# Altium schematic sheet 3_FLOATER.SchDoc
size A; SheetNumber: 3; SheetTotal: 3
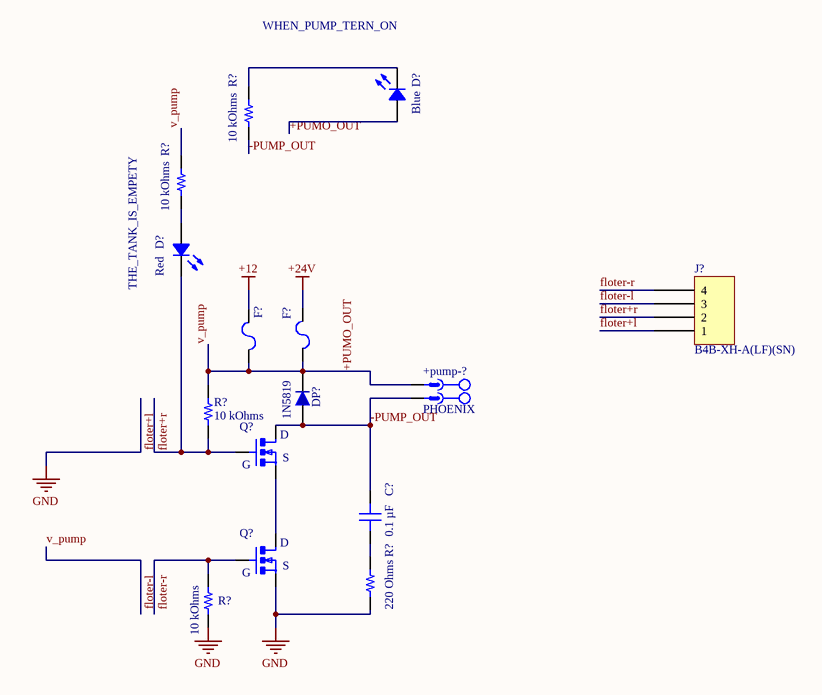
[diagram p0: 3_FLOATER.SchDoc]

## Parts
(Parts that share a designator on the sheet are numbered #1, #2 ... from top to bottom, then left to right.)
+pump-?  PHOENIX  [691321300002]
C?  0.1 µF  [CAP 0603_1608]
D?#1  Blue  [LED 0603_1608 BLUE]
D?#2  Red  [LED 0603_1608 RED]
DP?  1N5819  [1N5819]
F?#1  3413.0328.22  [FUSE 1206_3216 0.6MM]  (value not drawn)
F?#2  3413.0328.22  [FUSE 1206_3216 0.6MM]  (value not drawn)
J?  B4B-XH-A(LF)(SN)  [JST XH B4B-XH-A]
Q?#1  MTD20N03HDL-SMD  [MTD20N03HDL-SMD]  (value not drawn)
Q?#2  MTD20N03HDL-SMD  [MTD20N03HDL-SMD]  (value not drawn)
R?#1  10 kOhms  [RES 0603_1608]
R?#2  10 kOhms  [RES 0603_1608]
R?#3  10 kOhms  [RES 0603_1608]
R?#4  220 Ohms  [RES 0603_1608]
R?#5  10 kOhms  [RES 0603_1608]

## Nets
+12: F?#1.2
+24V: F?#2.2
floter+l: J?.1 Q?#2.3(S) R?#4.1 R?#5.1  [also labelled GND]
+PUMO_OUT: +pump-?.1 D?#1.1 DP?.2 F?#1.1 F?#2.1 J?.3 R?#2.2 R?#3.2  [also labelled floter-l, v_pump]
-PUMP_OUT: +pump-?.2 C?.2 DP?.1 Q?#1.2(D) R?#1.1
floter+r: D?#2.2 J?.2 Q?#1.1(G) R?#3.1
floter-r: J?.4 Q?#2.1(G) R?#5.2
NetC?_1: C?.1 R?#4.2
NetD?#1_2: D?#1.2 R?#1.2
NetD?#2_1: D?#2.1 R?#2.1
NetQ?#1_3: Q?#1.3(S) Q?#2.2(D)

## Notes on the sheet
- WHEN_PUMP_TERN_ON
- THE_TANK_IS_EMPETY

## Library data of the parts
+pump-? = KEY_1: 2 Pitch: 5.08 mm Color: green Contact surface: Tin Assembly_saf; Manufacturer: PHOENIX CONTACT; Connector type: PCB Terminal Block; designer: ABBAS BASEREH; Max Current: 12 A; Positions: 2; Voltage: 320 V; Category: Connector; ComponentLink1Description: Header, Nominal current: 12 A Rated voltage (III/2): 320 V Number of positions: 2 Pitch: 5.08 mm Color: green Contact surface: Tin Assembly: Soldering  DESIGNER:ABBAS BASEREH; ComponentLink2Description: Reference; Mounting Technology: Through-Hole; Pin Count: 2; Revision 1: 2017-3-1; Status: Unreleased; PART.NO: PHOENIX
C? = C0603C104K5RAC7411: CAP CER 0.1UF 50V X7R 0603; Part Number: C0603C104K5RAC7411; Value: 0.1 µF
D?#1 = SML-LX0603USBW-TR: LED 470NM USBLU WHT DF 0603 T/R; Manufacturer: Lumex Opto/Components Inc.; Configuration: Standard; Current - Test: 20mA; Lens Color: White; Lens Size: 1.00mm x 0.80mm; Lens Style: Rectangle with Flat Top; Lens Transparency: Diffused; Millicandela Rating: 112.5mcd; Viewing Angle: 140°; Voltage - Forward (Vf) (Typ): 3.3V; Part Number: SML-LX0603USBW-TR; Color: Blue; ComponentLink1Description: Datasheet; ComponentLink1URL: https://www.lumex.com/content/files/ProductAttachment/SML-LX0603USBW-TR.pdf; ComponentLink2Description: DigiKey Link; ComponentLink2URL: https://www.digikey.com/en/products/detail/lumex-opto-components-inc/SML-LX0603USBW-TR/515780; Device Package: 0603 (1608 Metric); Height (Max): 0.85mm; LastUpdated: 1/30/2023 8:49:34 PM; Lifecycle Status: Active; Minimum Order: 1; Mounting Type: Surface Mount; Package / Case: 0603 (1608 Metric); Packaging: TapeAndReel; PartId: 804; Part Status: Active; Price: 0.76; Series: -; Size / Dimension: 1.60mm L x 0.80mm W; Supplier 1: DigiKey; Supplier Part Number 1: 67-2305-1-ND; Supplier Device Package: 0603; Value: Blue; Wavelength - Peak: 470nm
D?#2 = CSL0901UT: HIGH BRIGHTNESS LENS TYPE LED; C; Manufacturer: Rohm Semiconductor; Configuration: 0603; Current - Test: 20mA; Lens Color: Colorless; Lens Size: 1.14mm Dia; Lens Style: Round with Domed Top; Lens Transparency: Clear; Millicandela Rating: 280mcd; Voltage - Forward (Vf) (Typ): 2.1V; Wavelength - Dominant: 620nm; Part Number: CSL0901UT; Color: Red; ComponentLink1Description: Datasheet; ComponentLink1URL: https://www.rohm.com/datasheet/CSL0901UT/csl0901-e; ComponentLink2Description: DigiKey Link; ComponentLink2URL: https://www.digikey.com/en/products/detail/rohm-semiconductor/CSL0901UT/10222160; Device Package: 0603 (1608 Metric); Height (Max): 1.34mm; LastUpdated: 1/30/2023 8:50:27 PM; Lifecycle Status: Active; Minimum Order: 1; Mounting Type: Surface Mount; Package / Case: 0603 (1608 Metric); Packaging: TapeAndReel; PartId: 428; Part Status: Active; Price: 0.12; Series: CSL090x; Size / Dimension: 1.60mm L x 0.80mm W; Supplier 1: DigiKey; Supplier Part Number 1: CSL0901UTCT-ND; Supplier Device Package: 0603; Value: Red
DP? = 1N5819: Schottkey Rectifiers; Designer: Abbas Basereh; Data: 16-12-2016; Link: *; Part. No: *
F?#1 F?#2 = 3413.0328.22: FUSE BOARD MOUNT 10A 32VAC 63VDC; Manufacturer: Schurter Inc.; Approval Agency: cURus; Breaking Capacity @ Rated Voltage: 100A; Fuse Type: Board Mount (Cartridge Style Excluded); Melting I²t: 21; Response Time: Slow Blow; Voltage Rating - AC: 32V; Voltage Rating - DC: 63V; Part Number: 3413.0328.22; Approvals: cURus; ComponentLink1Description: Datasheet; ComponentLink1URL: https://us.schurter.com/pdf/english/typ_UST_1206.pdf; ComponentLink2Description: DigiKey Link; ComponentLink2URL: http://digikey.com/product-detail/en/schurter-inc/3413.0328.22/486-1686-1-ND/2870095; Current Rating (Amps): 10A; Device Package: 1206 (3216 Metric); LastUpdated: 9/2/2020 1:30:41 AM; Lifecycle Status: Active; Minimum Order: 1; Mounting Type: Surface Mount; Operating Temperature: -55°C ~ 90°C; Package / Case: 1206 (3216 Metric); Packaging: TapeAndReel; Part Status: Active; Price: 0.21; Series: UST 1206; Size / Dimension: 0.126" L x 0.063" W x 0.024" H (3.20mm x 1.60mm x 0.60mm); Supplier 1: DigiKey; Supplier Part Number 1: 486-1686-1-ND
J? = B4B-XH-A(LF)(SN): CONN HEADER VERT 4POS 2.5MM; Manufacturer: JST Sales America Inc.; Contact Length - Post: 0.134" (3.40mm); Current Rating (Amps): 3A; Material Flammability Rating: UL94 V-0; Number of Positions: 4; Number of Positions Loaded: All; Pitch - Mating: 0.098" (2.50mm); Shrouding: Shrouded - 4 Wall; Style: Board to Cable/Wire; Voltage Rating: 250V; Part Number: B4B-XH-A(LF)(SN); ComponentLink1Description: Datasheet; ComponentLink1URL: http://www.jst-mfg.com/product/pdf/eng/eXH.pdf; ComponentLink2Description: DigiKey Link; ComponentLink2URL: http://digikey.com/product-detail/en/jst-sales-america-inc/B4B-XH-A-LF-SN/455-2249-ND/1651047; Connector Type: Header; Contact Finish - Mating: Tin; Contact Finish - Post: Tin; Contact Material: Brass; Contact Shape: Square; Contact Type: Male Pin; Fastening Type: Detent Lock; Insulation Color: Natural; Insulation Height: 0.276" (7.00mm); Insulation Material: Polyamide (PA66), Nylon 6/6; LastUpdated: 1/12/2020 11:46:34 PM; Lifecycle Status: Active; Minimum Order: 1; Mounting Type: Through Hole; Number of Rows: 1; Operating Temperature: -25°C ~ 85°C; Packaging: Bulk; PartId: 69; Part Status: Active; Price: 0.21; Series: XH; Supplier 1: DigiKey; Supplier Part Number 1: 455-2249-ND; Termination: Press-Fit, Solder
Q?#1 Q?#2 = MTD20N03HDL-SMD: N-Channel 55V 29A (Tc) 3.8W (Ta), 68W (Tc) Surface Mount D2PAK; MP: IRFZ34N; MF: Infineon / IR; Price: None; Value: *; Package: TO-220-3 Infineon / IR; SnapEDA_Link: https://www.snapeda.com/parts/IRFZ34N/Infineon/view-part/4702946/?ref=snap; Check_prices: https://www.snapeda.com/parts/IRFZ34N/Infineon/view-part/4702946/?ref=eda; Availability: Bad
R?#1-R?#3 R?#5 = RNCS0603BKE10K0: RES 10K OHM 0.1% 1/16W 0603; Manufacturer: Stackpole Electronics Inc; Power (Watts): 0.063W, 1/16W; Temperature Coefficient: ±25ppm/°C; Part Number: RNCS0603BKE10K0; Value: 10 kOhms; ComponentLink1Description: Datasheet; ComponentLink1URL: https://www.seielect.com/catalog/sei-rncs_rnch.pdf; ComponentLink2Description: DigiKey Link; ComponentLink2URL: https://www.digikey.com/en/products/detail/stackpole-electronics-inc/RNCS0603BKE10K0/1708836; Composition: Thin Film; Device Package: 0603 (1608 Metric); Features: Anti-Corrosive, Automotive AEC-Q200, Moisture Resistant; Height - Seated (Max): 0.022" (0.55mm); LastUpdated: 9/19/2022 1:22:34 PM; Lifecycle Status: Active; Minimum Order: 1; Number of Terminations: 2; Operating Temperature: -55°C ~ 155°C; Package / Case: 0603 (1608 Metric); Packaging: TapeAndReel; PartId: 4838; Part Status: Active; Price: 0.07; Ratings: AEC-Q200; Resistance: 10 kOhms; Series: RNCS; Size / Dimension: 0.061" L x 0.031" W (1.55mm x 0.80mm); Supplier 1: DigiKey; Supplier Part Number 1: RNCS0603BKE10K0CT-ND; Supplier Device Package: 0603; Tolerance: ±0.1%
R?#4 = CRCW0603220RFKEA: RES SMD 220 OHM 1% 1/10W 0603; Part Number: CRCW0603220RFKEA; Value: 220 Ohms